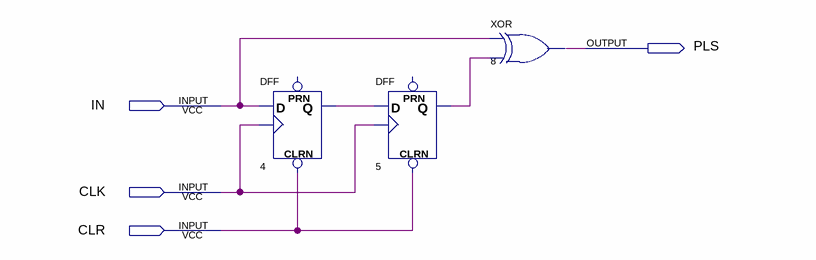
[diagram p0: schematic sheet]
// Quartus schematic plsgen.bdf as structural Verilog: 3 symbols, 4 pins
module plsgen (
  input  IN,
  input  CLK,
  input  CLR,
  output PLS
);

  wire n4_q, n5_q;

  DFF u_4 (.CLRN(CLR), .CLK(CLK), .D(IN), .Q(n4_q));  // open: PRN
  DFF u_5 (.CLRN(CLR), .CLK(CLK), .D(n4_q), .Q(n5_q));  // open: PRN
  xor u_8 (PLS, IN, n5_q);
endmodule
